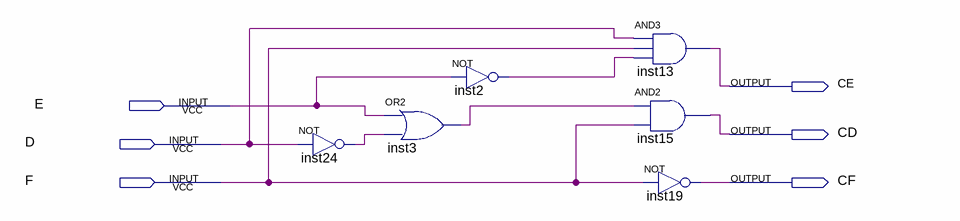
[diagram p0: schematic sheet]
// Quartus schematic aula03.bdf as structural Verilog: 6 symbols, 6 pins
module aula03 (
  input  E,
  input  D,
  input  F,
  output CE,
  output CD,
  output CF
);

  wire inst2_out, inst3_out, inst24_out;

  not inst24 (inst24_out, D);
  or inst3 (inst3_out, E, inst24_out);
  not inst2 (inst2_out, E);
  and inst13 (CE, D, F, inst2_out);
  and inst15 (CD, inst3_out, F);
  not inst19 (CF, F);
endmodule
